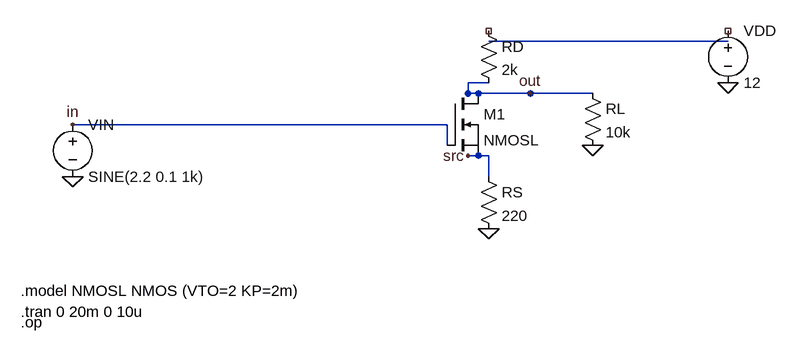
[diagram p0: schematic common_source_nmos.asc]
common_source_nmos.asc, the LTspice schematic file:
Version 4
SHEET 1 1800 1100
WIRE 128 320 704 320
WIRE 704 320 704 352
WIRE 1136 192 768 192
WIRE 768 256 736 256
WIRE 736 256 736 272
WIRE 736 368 768 368
WIRE 768 368 768 400
WIRE 736 272 928 272
WIRE 736 272 832 272
FLAG 128 320 in
FLAG 832 272 out
FLAG 736 368 src
FLAG 128 400 0
FLAG 1136 256 0
FLAG 768 480 0
FLAG 928 352 0
SYMBOL voltage 128 304 R0
SYMATTR InstName VIN
SYMATTR Value SINE(2.2 0.1 1k)
SYMBOL nmos 704 272 R0
SYMATTR InstName M1
SYMATTR Value NMOSL
SYMBOL res 752 160 R0
SYMATTR InstName RD
SYMATTR Value 2k
SYMBOL res 752 384 R0
SYMATTR InstName RS
SYMATTR Value 220
SYMBOL res 912 256 R0
SYMATTR InstName RL
SYMATTR Value 10k
SYMBOL voltage 1136 160 R0
SYMATTR InstName VDD
SYMATTR Value 12
TEXT 48 576 Left 2 !.model NMOSL NMOS (VTO=2 KP=2m)
TEXT 48 608 Left 2 !.tran 0 20m 0 10u
TEXT 48 624 Left 2 !.op

The netlist it stands for:
* common_source_nmos.asc
VIN in 0 SINE(2.2 0.1 1k)
M1 out in src src NMOSL
RD NC_01 out 2k
RS src 0 220
RL out 0 10k
VDD NC_02 0 12
.model NMOS NMOS
.model PMOS PMOS
.lib standard.mos
.model NMOSL NMOS (VTO=2 KP=2m)
.tran 0 20m 0 10u
.op
.backanno
.end